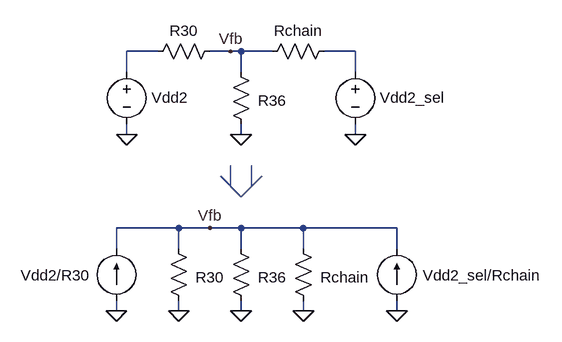
[diagram p0: schematic regulator_northon.asc]
regulator_northon.asc, the LTspice schematic file:
Version 4
SHEET 1 880 680
WIRE 112 32 64 32
WIRE 224 32 192 32
WIRE 240 32 224 32
WIRE 288 32 240 32
WIRE 416 32 368 32
WIRE 64 64 64 32
WIRE 240 64 240 32
WIRE 416 64 416 32
WIRE 64 160 64 144
WIRE 240 160 240 144
WIRE 416 160 416 144
WIRE 144 304 48 304
WIRE 192 304 144 304
WIRE 240 304 192 304
WIRE 336 304 240 304
WIRE 480 304 336 304
WIRE 48 336 48 304
WIRE 144 336 144 304
WIRE 240 336 240 304
WIRE 336 336 336 304
WIRE 480 336 480 304
WIRE 48 432 48 416
WIRE 144 432 144 416
WIRE 240 432 240 416
WIRE 336 432 336 416
WIRE 480 432 480 416
FLAG 64 160 0
FLAG 240 160 0
FLAG 416 160 0
FLAG 224 32 Vfb
FLAG 240 432 0
FLAG 192 304 Vfb
FLAG 144 432 0
FLAG 336 432 0
FLAG 48 432 0
FLAG 480 432 0
SYMBOL voltage 64 48 R0
WINDOW 0 38 55 Left 2
WINDOW 3 24 96 Invisible 2
SYMATTR InstName Vdd2
SYMBOL res 224 48 R0
WINDOW 0 42 60 Left 2
WINDOW 3 36 76 Invisible 2
SYMATTR InstName R36
SYMBOL voltage 416 48 R0
WINDOW 0 38 55 Left 2
WINDOW 3 24 96 Invisible 2
SYMATTR InstName Vdd2_sel
SYMBOL res 208 16 R90
WINDOW 0 0 56 VBottom 2
WINDOW 3 32 56 Invisible 2
SYMATTR InstName R30
SYMBOL res 384 16 R90
WINDOW 0 0 56 VBottom 2
WINDOW 3 32 56 Invisible 2
SYMATTR InstName Rchain
SYMBOL res 224 320 R0
WINDOW 0 42 60 Left 2
WINDOW 3 36 76 Invisible 2
SYMATTR InstName R36
SYMBOL res 128 320 R0
WINDOW 0 42 60 Left 2
WINDOW 3 36 76 Invisible 2
SYMATTR InstName R30
SYMBOL res 320 320 R0
WINDOW 0 42 60 Left 2
WINDOW 3 36 76 Invisible 2
SYMATTR InstName Rchain
SYMBOL current 48 416 R180
WINDOW 0 40 39 Left 2
WINDOW 3 24 0 Invisible 2
SYMATTR InstName Vdd2/R30
SYMBOL current 480 416 M180
WINDOW 0 40 39 Left 2
WINDOW 3 24 0 Invisible 2
SYMATTR InstName Vdd2_sel/Rchain
LINE Normal 224 240 224 208
LINE Normal 224 240 224 240
LINE Normal 256 240 256 208
LINE Normal 272 224 240 256
LINE Normal 208 224 240 256

The netlist it stands for:
* regulator_northon.asc
Vdd2 N001 0 V
R36 Vfb 0 R
Vdd2_sel N002 0 V
R30 Vfb N001 R
Rchain N002 Vfb R
R36 Vfb 0 R
R30 Vfb 0 R
Rchain Vfb 0 R
I§Vdd2/R30 0 Vfb I
I§Vdd2_sel/Rchain 0 Vfb I
.backanno
.end